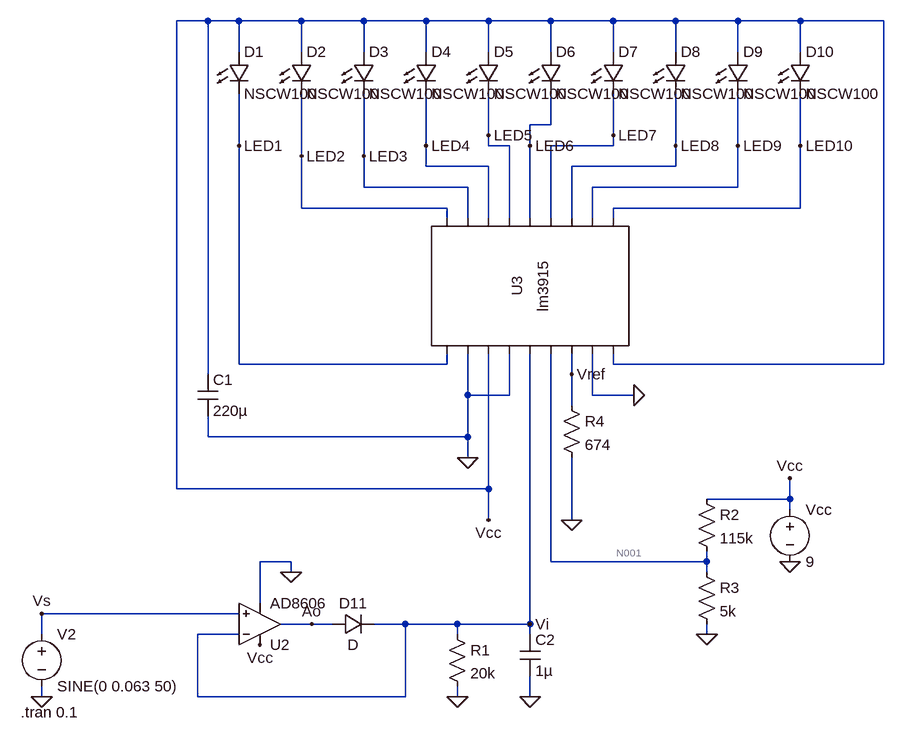
[diagram p0: schematic LM3915_Base_CircuitV2.asc]
* LM3915_Base_CircuitV2.asc
D1 Vcc LED1 NSCW100
D2 Vcc LED2 NSCW100
D3 Vcc LED3 NSCW100
D4 Vcc LED4 NSCW100
D5 Vcc LED5 NSCW100
D6 Vcc LED6 NSCW100
D7 Vcc LED7 NSCW100
D8 Vcc LED8 NSCW100
D9 Vcc LED9 NSCW100
D10 Vcc LED10 NSCW100
C1 Vcc 0 220µ
Vcc Vcc 0 9
V2 Vs 0 SINE(0 0.063 50)
R1 Vi 0 20k
D11 Ao Vi D
XU2 Vs Vi Vcc 0 Ao AD8606  ; pins In+ In- V+ V- OUT
C2 Vi 0 1µ
* U3: lm3915 (symbol AutoGenerated\lm3915 not available, pins judged from their places): pin1=LED1 pin2=0 pin3=Vcc pin4=0 pin5=Vi pin6=N001 pin7=Vref pin8=0 pin9=Vcc pin10=LED2 pin11=LED3 pin12=LED4 pin13=LED5 pin14=LED6 pin15=LED7 pin16=LED8 pin17=LED9 pin18=LED10
R2 Vcc N001 115k
R3 N001 0 5k
R4 Vref 0 674
.model D D
.lib standard.dio
.tran 0.1
.lib ADI.lib
.backanno
.end

* Results of the author's LTspice run, read from the files saved beside the schematic
* Operating Point, zero values left out:
*   V(vcc) = 9 V
*   V(led1) = 7.98 V
*   V(led2) = 7.98 V
*   V(led3) = 7.98 V
*   V(led4) = 7.98 V
*   V(led5) = 7.98 V
*   V(led6) = 7.98 V
*   V(led7) = 7.98 V
*   V(led8) = 7.98 V
*   V(led9) = 7.98 V
*   V(led10) = 7.98 V
*   V(vi) = -195 µV
*   V(ao) = 368.1 mV
*   V(vref) = 1.28 V
*   V(n001) = 320.2 mV
*   I(D11) = 15.25 nA
*   I(D10) = 1 µA
*   I(D9) = 1 µA
*   I(D8) = 1 µA
*   I(D7) = 1 µA
*   I(D6) = 1 µA
*   I(D5) = 1 µA
*   I(D4) = 1 µA
*   I(D3) = 1 µA
*   I(D2) = 1 µA
*   I(D1) = 1 µA
*   I(R4) = 1.274 µA
*   I(R3) = 64.04 µA
*   I(R2) = 75.48 µA
*   I(R1) = -9.751 nA
*   I(Vcc) = -4.154 mA
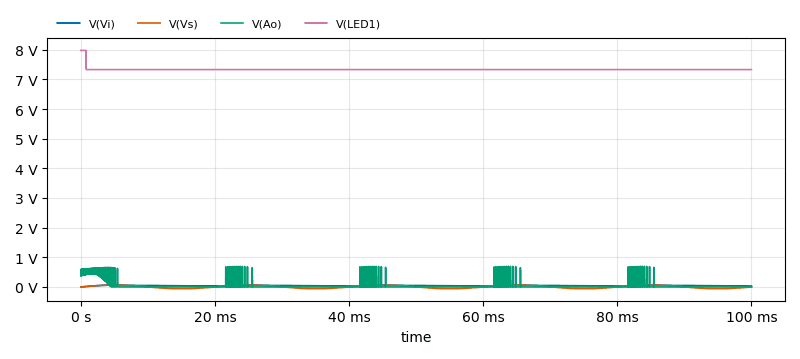
[diagram p1: Transient Analysis of LM3915_Base_CircuitV2.asc, plotted from the saved traces]
* Transient Analysis, 1 run:
*   V(Vi): min -195 µV, max 63.73 mV, average 44.51 mV, rms 45.92 mV, last 30.03 mV
*   V(Vs): min -62.88 mV, max 63 mV, average 145.5 µV, rms 44.46 mV, last 0 V
*   V(Ao): min -98.94 µV, max 693.9 mV, average 29.75 mV, rms 122.3 mV, last 0 V
*   V(LED1): min 7.331 V, max 7.98 V, average 7.336 V, rms 7.336 V, last 7.331 V